# EAGLE design tape64v2 (EAGLE 6.2)
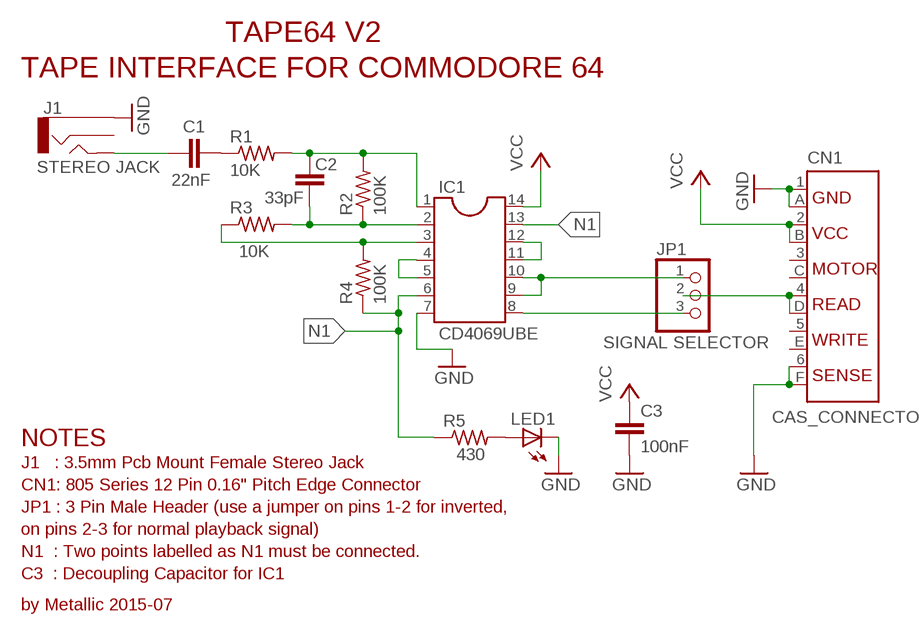
[diagram p0: schematic, sheet 1]

## Parts
C1  22nF  C-EU050-025X075  [C050-025X075]
C2  33pF  C-EU025-024X044  [C025-024X044]
C3  100nF  C-EU050-035X075  [C050-035X075]
CN1  CAS_CONNECTOR  CAS_CON  [CAS_CON]
IC1  CD4069UBE  DIL14  [DIL14]
J1  STEREO JACK  AUDIO-JACKPTH  [AUDIO-JACK]
JP1  SIGNAL SELECTOR  PINHD-1X3  [1X03]
LED1  LED3MM  [LED3MM]
R1  10K  R-US_0207/10  [0207/10]
R2  100K  R-US_0207/10  [0207/10]
R3  10K  R-US_0207/10  [0207/10]
R4  100K  R-US_0207/10  [0207/10]
R5  430  R-US_0207/10  [0207/10]

## Nets
GND: C3.2 CN1.1(GND1) CN1.6(SENSE1) CN1.A(GND2) CN1.F(SENSE2) IC1.7 J1.1 LED1.K(C)
N1: IC1.6 IC1.13 R4.1 R5.1
N$1: IC1.3 R3.1 R4.2
N$2: C1.1 J1.5
N$3: C2.2 IC1.1 R1.2 R2.2
N$4: IC1.4 IC1.5
N$5: C2.1 IC1.2 R2.1 R3.2
N$6: IC1.11 IC1.12
N$7: IC1.9 IC1.10 JP1.1
N$8: IC1.8 JP1.3
N$9: CN1.4(READ1) CN1.D(READ2) JP1.2
N$10: LED1.A R5.2
N$11: C1.2 R1.1
VCC: C3.1 CN1.2(VCC1) CN1.B(VCC2) IC1.14
Unconnected: CN1.3(MOTOR1) CN1.5(WRITE1) CN1.C(MOTOR2) CN1.E(WRITE2) J1.2

## Notes on the sheet
- TAPE64 V2
- TAPE INTERFACE FOR COMMODORE 64
- NOTES
- J1   : 3.5mm Pcb Mount Female Stereo Jack
- CN1: 805 Series 12 Pin 0.16" Pitch Edge Connector
- JP1 : 3 Pin Male Header (use a jumper on pins 1-2 for inverted,
- on pins 2-3 for normal playback signal)
- N1  : Two points labelled as N1 must be connected.
- C3  : Decoupling Capacitor for IC1
- by Metallic 2015-07

## Library data of the parts
C1-C3 = rcl:C-EU: CAPACITOR, European symbol
CN1 = mtl_c64:CAS_CON
IC1 = ic-package:DIL14: Dual In Line / Socket
J1 = SparkFun:AUDIO-JACK: 3.5mm Audio Jack Simple 3.5mm common PCB mount audio jack. SKU: PRT-08032
JP1 = pinhead:PINHD-1X3: PIN HEADER
LED1 = adafruit:LED: LED OSRAM: - CHIPLED LG R971, LG N971, LY N971, LG Q971, LY Q971, LO R971, LY R971 LH N974, LH R974 LS Q976, LO Q976, LY Q976 LO Q996 - Hyper CHIPLED LW Q18S LB Q993, LB Q99A, LB R99A - SideLED LS A670, LO A670, LY A670, LG A670, LP A670 LB A673, LV A673, LT A673, LW A673 LH A674 LY A675 LS A676, LA A676, LO A676, LY A676, LW A676 LS A679, LY A679, LG A679 - Hyper Micro SIDELED® LS Y876, LA Y876, LO Y876, LY Y876 LT Y87S - SmartLED LW L88C, LW L88S LB L89C, LB L89S, LG L890 LS L89K, LO L89K, LY L89K LS L896, LA L896, LO L896, LY L896 - TOPLED LS T670, LO T670, LY T670, LG T670, LP T670 LSG T670, LSP T670, LSY T670, LOP T670, LYG T670 LG T671, LOG T671, LSG T671 LB T673, LV T673, LT T673, LW T673 LH T674 LS T676, LA T676, LO T676, LY T676, LB T676, LH T676, LSB T676, LW T676 LB T67C, LV T67C, LT T67C, LS T67K, LO T67K, LY T67K, LW E67C LS E67B, LA E67B, LO E67B, LY E67B, LB E67C, LV E67C, LT E67C LW T67C LS T679, LY T679, LG T679 LS T770, LO T770, LY T770, LG T770, LP T770 LB T773, LV T773, LT T773, LW T773 LH T774 LS E675, LA E675, LY E675, LS T675 LS T776, LA T776, LO T776, LY T776, LB T776 LHGB T686 LT T68C, LB T68C - Hyper Mini TOPLED® LB M676 - Mini TOPLED Santana® LG M470 LS M47K, LO M47K, LY M47K Source: http://www.osram.convergy.de/
R1-R5 = rcl:R-US_: RESISTOR, American symbol

## Board
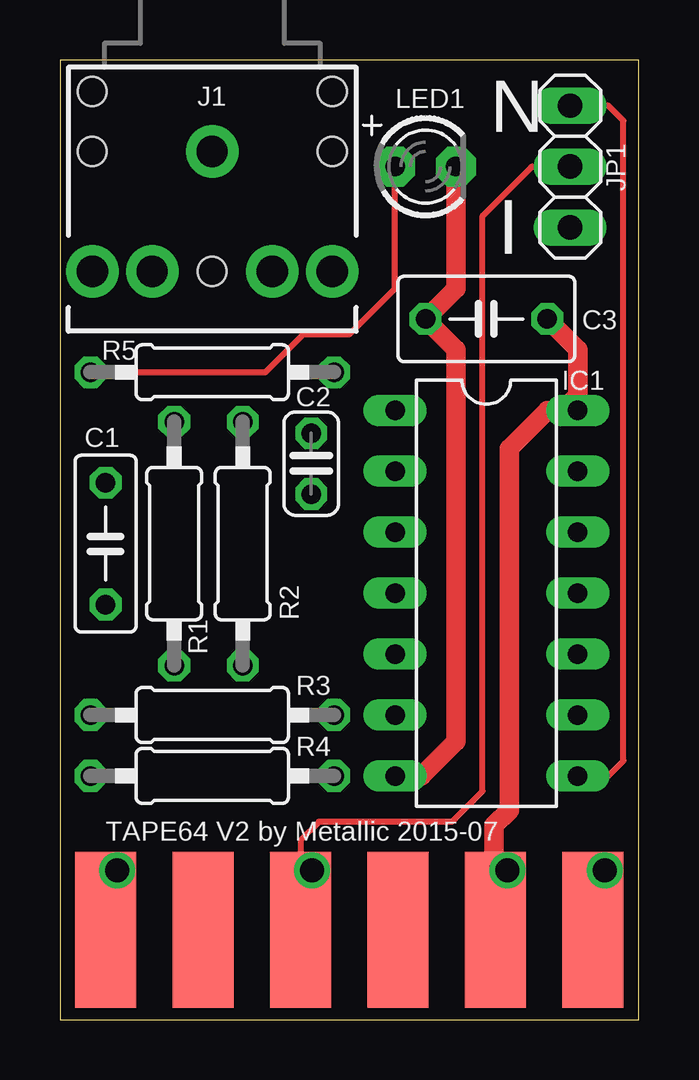
[diagram p1: board, top side]
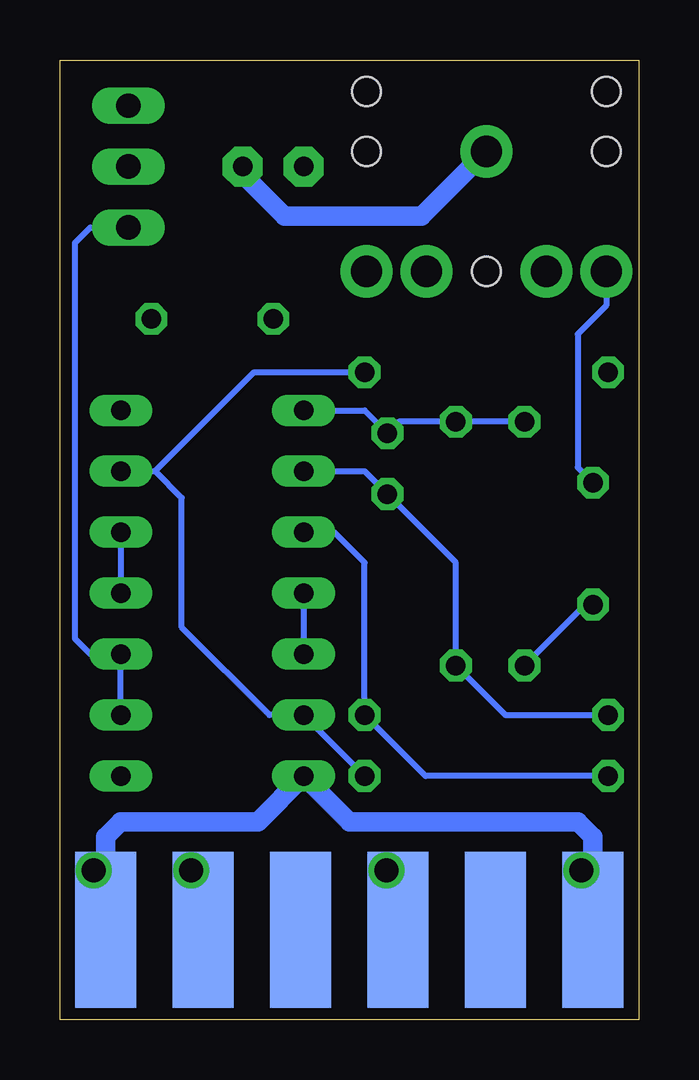
[diagram p2: board, bottom side, seen from below]

Size 24.13 x 40.01 mm. Coordinates in mm from the lower left corner, seen from the top.
Outline: 0,0 24.13,0 24.13,40.01 0,40.01 0,0
Copper layers (1*16): Top 0.035mm / dielectric 1.5mm / Bottom 0.035mm
Design rules: minimum track width 5mil, minimum drill 12mil, track to track 5mil, track to pad 5mil, pad to pad 5mil, via to via 5mil, smd to smd 0mil, copper to edge 10mil, drill to drill 10mil, minimum pad ring 10mil, minimum via ring 6mil, stop-mask expansion 2mil, vias tented up to drill 25mil, thermal gap 10mil

### Footprints (pad centres in the part's own frame; a part is rotated, then mirrored left to right if it is on the bottom)
C050-025X075 = drill 0.813 octagon: 1 -2.54,0; 2 2.54,0
C025-024X044 = drill 0.813 octagon: 1 -1.27,0; 2 1.27,0
C050-035X075 = drill 0.813 octagon: 1 -2.54,0; 2 2.54,0
CAS_CON = smd 2.54 x 6.5: 1 10.16,3.75; 2 6.096,3.75; 3 2.032,3.75; 4 -2.032,3.75; 5 -6.096,3.75; 6 -10.16,3.75 | smd 2.54 x 6.5 bottom: A 10.16,3.75; B 6.096,3.75; C 2.032,3.75; D -2.032,3.75; E -6.096,3.75; F -10.16,3.75
DIL14 = drill 0.813 long: 1 -7.62,-3.81; 2 -5.08,-3.81; 3 -2.54,-3.81; 4 0,-3.81; 5 2.54,-3.81; 6 5.08,-3.81; 7 7.62,-3.81; 8 7.62,3.81; 9 5.08,3.81; 10 2.54,3.81; 11 0,3.81; 12 -2.54,3.81; 13 -5.08,3.81; 14 -7.62,3.81
AUDIO-JACK = drill 1.3 pad 2.184: 1 0,0; 2 5,5; 3 5,2.5; 4 5,-2.5; 5 5,-5 | hole 1.2: 0,5; -2.5,5; -2.5,-5; 0,-5; 5,0
1X03 = drill 1.016 long: 1 -2.54,0; 2 0,0; 3 2.54,0
LED3MM = drill 0.813 pad 1.676 octagon: A -1.27,0; K 1.27,0
0207/10 = drill 0.813 octagon: 1 -5.08,0; 2 5.08,0

### Placement (x,y rotation side)
C1  1.91,19.84 270 top
C2  10.48,23.18 90 top
C3  17.78,29.21 180 top
CN1  12.06,0 0 top
IC1  17.78,17.78 270 top
J1  6.35,36.2 270 top
JP1  21.27,35.56 90 top
LED1  15.24,35.56 0 top
R1  4.76,19.84 90 top
R2  7.62,19.84 90 top
R3  6.35,12.7 180 top
R4  6.35,10.16 180 top
R5  6.35,26.99 180 top

### Tracks (layer width: path | path; a pad name or v marks a point on that pad's centre or on a via)
GND  (via drill 1)
  Top 0.254: CN1.1 22.23,5.77 v22.71,6.22 | CN1.6 1.91,5.79 v2.39,6.22
  Top 0.813: LED1.K 16.51,30.48 C3.2 16.51,27.94 16.51,11.59 15.08,10.16 IC1.7
  Bottom 0.254: v22.71,6.22 23.05,4.58 CN1.1 | v2.39,6.22 2.79,4.64 CN1.6
  Bottom 0.813: J1.1 9.05,33.5 14.76,33.5 16.51,35.24 LED1.K | CN1.1 22.23,7.62 21.59,8.26 15.88,8.26 IC1.7 12.06,8.26 2.54,8.26 1.91,7.62 CN1.6
N1
  Bottom 0.254: 20.16,22.86 19.05,21.75 19.05,16.35 15.4,12.7 IC1.6 R4.1 | IC1.13 20.16,22.86 | 20.16,22.86 16.03,26.99 R5.1
N$1
  Bottom 0.254: IC1.3 12.7,20.32 11.43,19.05 R3.1 8.89,10.16 R4.2
N$2
  Bottom 0.254: J1.5 1.35,29.77 2.54,28.57 2.54,23.02 C1.1
N$3
  Bottom 0.254: R1.2 R2.2 10,24.92 C2.2 11.43,25.4 IC1.1
N$4
  Bottom 0.254: IC1.4 IC1.5
N$5
  Bottom 0.254: IC1.2 11.43,22.86 C2.1 7.62,19.05 R2.1 5.56,12.7 R3.2
N$6
  Bottom 0.254: IC1.12 IC1.11
N$7
  Bottom 0.254: IC1.9 IC1.10 22.86,15.24 23.5,15.88 23.5,32.38 22.86,33.02 JP1.1
N$8
  Top 0.254: IC1.8 22.86,10.16 23.5,10.79 23.5,37.47 22.86,38.1 JP1.3
N$9  (via drill 1)
  Top 0.254: JP1.2 19.68,35.56 17.62,33.5 17.62,9.53 16.35,8.26 10.79,8.26 10.03,7.49 CN1.D | 10.16,3.3 CN1.D | v10.52,6.22 10.92,4.64 CN1.D
  Bottom 0.254: CN1.D 10.03,5.72 v10.52,6.22
N$10
  Top 0.254: R5.2 8.57,26.99 10.16,28.57 12.06,28.57 13.97,30.48 LED1.A
N$11
  Bottom 0.254: C1.2 2.22,17.3 R1.1
VCC  (via drill 1)
  Top 0.254: CN1.B 18.16,5.46 v18.65,6.22 19.05,4.64 CN1.B
  Top 0.813: C3.1 21.59,27.94 21.59,26.04 | 21.59,26.04 IC1.14 | 21.59,26.04 20.95,25.4 20.32,25.4 18.73,23.81 18.73,8.73 18.1,8.1 18.1,3.81 CN1.B
  Bottom 0.254: CN1.B 18.16,5.46 v18.65,6.22

### Text on the board
_tsilk: N | I | TAPE64 V2 by Metallic 2015-07